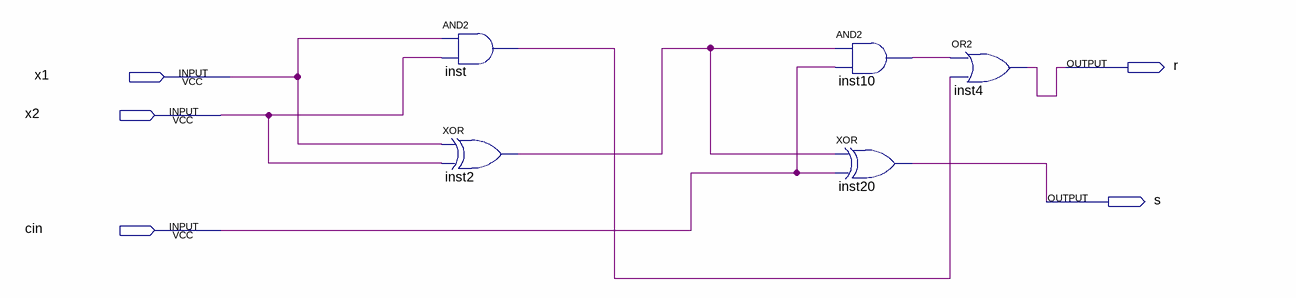
[diagram p0: schematic sheet]
// Quartus schematic adicionaire1BIT.bdf as structural Verilog: 5 symbols, 5 pins
module adicionaire1BIT (
  input  x1,
  input  x2,
  input  cin,
  output r,
  output s
);

  wire inst2_out, inst10_out, inst_out;

  and inst (inst_out, x1, x2);
  xor inst2 (inst2_out, x1, x2);
  and inst10 (inst10_out, inst2_out, cin);
  xor inst20 (s, inst2_out, cin);
  or inst4 (r, inst10_out, inst_out);
endmodule
